# Altium schematic sheet 5V_switches.SchDoc: Data Logger - 5V Switches
size A4; DocumentNumber: DL-MB-5; SheetNumber: 5; SheetTotal: 11
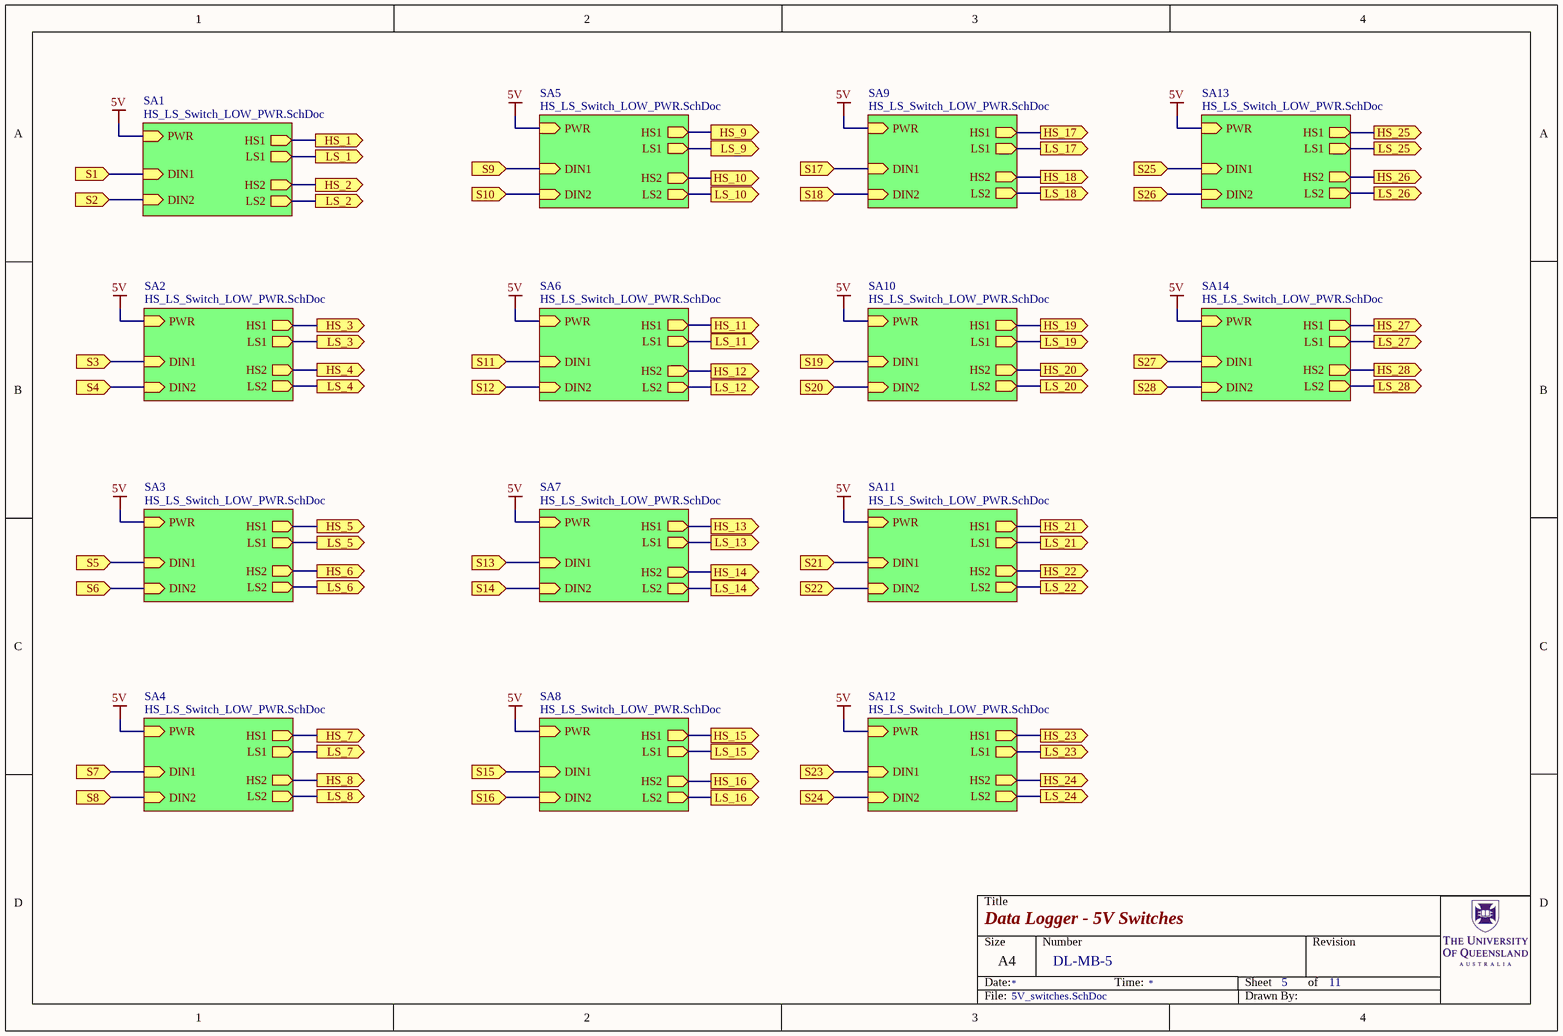
[diagram p0: 5V_switches.SchDoc]

## Sub-sheets
SA1 = HS_LS_Switch_LOW_PWR.SchDoc: DIN1 (in), DIN2 (in), HS1 (out), LS1 (out), HS2 (out), LS2 (out), PWR (in)
SA2 = HS_LS_Switch_LOW_PWR.SchDoc: DIN1 (in), DIN2 (in), HS1 (out), LS1 (out), HS2 (out), LS2 (out), PWR (in)
SA3 = HS_LS_Switch_LOW_PWR.SchDoc: DIN1 (in), DIN2 (in), HS1 (out), LS1 (out), HS2 (out), LS2 (out), PWR (in)
SA4 = HS_LS_Switch_LOW_PWR.SchDoc: DIN1 (in), DIN2 (in), HS1 (out), LS1 (out), HS2 (out), LS2 (out), PWR (in)
SA5 = HS_LS_Switch_LOW_PWR.SchDoc: DIN1 (in), DIN2 (in), HS1 (out), LS1 (out), HS2 (out), LS2 (out), PWR (in)
SA6 = HS_LS_Switch_LOW_PWR.SchDoc: DIN1 (in), DIN2 (in), HS1 (out), LS1 (out), HS2 (out), LS2 (out), PWR (in)
SA7 = HS_LS_Switch_LOW_PWR.SchDoc: DIN1 (in), DIN2 (in), HS1 (out), LS1 (out), HS2 (out), LS2 (out), PWR (in)
SA8 = HS_LS_Switch_LOW_PWR.SchDoc: DIN1 (in), DIN2 (in), HS1 (out), LS1 (out), HS2 (out), LS2 (out), PWR (in)
SA9 = HS_LS_Switch_LOW_PWR.SchDoc: DIN1 (in), DIN2 (in), HS1 (out), LS1 (out), HS2 (out), LS2 (out), PWR (in)
SA10 = HS_LS_Switch_LOW_PWR.SchDoc: DIN1 (in), DIN2 (in), HS1 (out), LS1 (out), HS2 (out), LS2 (out), PWR (in)
SA11 = HS_LS_Switch_LOW_PWR.SchDoc: DIN1 (in), DIN2 (in), HS1 (out), LS1 (out), HS2 (out), LS2 (out), PWR (in)
SA12 = HS_LS_Switch_LOW_PWR.SchDoc: DIN1 (in), DIN2 (in), HS1 (out), LS1 (out), HS2 (out), LS2 (out), PWR (in)
SA13 = HS_LS_Switch_LOW_PWR.SchDoc: DIN1 (in), DIN2 (in), HS1 (out), LS1 (out), HS2 (out), LS2 (out), PWR (in)
SA14 = HS_LS_Switch_LOW_PWR.SchDoc: DIN1 (in), DIN2 (in), HS1 (out), LS1 (out), HS2 (out), LS2 (out), PWR (in)

## Ports
HS_1 (out), HS_2 (out), HS_3 (out), HS_4 (out), HS_5 (out), HS_6 (out), HS_7 (out), HS_8 (out), HS_9 (out), HS_10 (out), HS_11 (out), HS_12 (out), HS_13 (out), HS_14 (out), HS_15 (out), HS_16 (out), HS_17 (out), HS_18 (out), HS_19 (out), HS_20 (out), HS_21 (out), HS_22 (out), HS_23 (out), HS_24 (out), HS_25 (out), HS_26 (out), HS_27 (out), HS_28 (out), LS_1 (out), LS_2 (out), LS_3 (out), LS_4 (out), LS_5 (out), LS_6 (out), LS_7 (out), LS_8 (out), LS_9 (out), LS_10 (out), LS_11 (out), LS_12 (out), LS_13 (out), LS_14 (out), LS_15 (out), LS_16 (out), LS_17 (out), LS_18 (out), LS_19 (out), LS_20 (out), LS_21 (out), LS_22 (out), LS_23 (out), LS_24 (out), LS_25 (out), LS_26 (out), LS_27 (out), LS_28 (out), S1 (in), S2 (in), S3 (in), S4 (in), S5 (in), S6 (in), S7 (in), S8 (in), S9 (in), S10 (in), S11 (in), S12 (in), S13 (in), S14 (in), S15 (in), S16 (in), S17 (in), S18 (in), S19 (in), S20 (in), S21 (in), S22 (in), S23 (in), S24 (in), S25 (in), S26 (in), S27 (in), S28 (in)

## Nets
5V: sheet SA1/PWR, sheet SA2/PWR, sheet SA3/PWR, sheet SA4/PWR, sheet SA5/PWR, sheet SA9/PWR, sheet SA10/PWR, sheet SA11/PWR, sheet SA12/PWR, sheet SA13/PWR, sheet SA14/PWR, sheet SA6/PWR, sheet SA7/PWR, sheet SA8/PWR
HS_1: port HS_1, sheet SA1/HS1
HS_2: port HS_2, sheet SA1/HS2
HS_3: port HS_3, sheet SA2/HS1
HS_4: port HS_4, sheet SA2/HS2
HS_5: port HS_5, sheet SA3/HS1
HS_6: port HS_6, sheet SA3/HS2
HS_7: port HS_7, sheet SA4/HS1
HS_8: port HS_8, sheet SA4/HS2
HS_9: port HS_9, sheet SA5/HS1
HS_10: port HS_10, sheet SA5/HS2
HS_11: port HS_11, sheet SA6/HS1
HS_12: port HS_12, sheet SA6/HS2
HS_13: port HS_13, sheet SA7/HS1
HS_14: port HS_14, sheet SA7/HS2
HS_15: port HS_15, sheet SA8/HS1
HS_16: port HS_16, sheet SA8/HS2
HS_17: port HS_17, sheet SA9/HS1
HS_18: port HS_18, sheet SA9/HS2
HS_19: port HS_19, sheet SA10/HS1
HS_20: port HS_20, sheet SA10/HS2
HS_21: port HS_21, sheet SA11/HS1
HS_22: port HS_22, sheet SA11/HS2
HS_23: port HS_23, sheet SA12/HS1
HS_24: port HS_24, sheet SA12/HS2
HS_25: port HS_25, sheet SA13/HS1
HS_26: port HS_26, sheet SA13/HS2
HS_27: port HS_27, sheet SA14/HS1
HS_28: port HS_28, sheet SA14/HS2
LS_1: port LS_1, sheet SA1/LS1
LS_2: port LS_2, sheet SA1/LS2
LS_3: port LS_3, sheet SA2/LS1
LS_4: port LS_4, sheet SA2/LS2
LS_5: port LS_5, sheet SA3/LS1
LS_6: port LS_6, sheet SA3/LS2
LS_7: port LS_7, sheet SA4/LS1
LS_8: port LS_8, sheet SA4/LS2
LS_9: port LS_9, sheet SA5/LS1
LS_10: port LS_10, sheet SA5/LS2
LS_11: port LS_11, sheet SA6/LS1
LS_12: port LS_12, sheet SA6/LS2
LS_13: port LS_13, sheet SA7/LS1
LS_14: port LS_14, sheet SA7/LS2
LS_15: port LS_15, sheet SA8/LS1
LS_16: port LS_16, sheet SA8/LS2
LS_17: port LS_17, sheet SA9/LS1
LS_18: port LS_18, sheet SA9/LS2
LS_19: port LS_19, sheet SA10/LS1
LS_20: port LS_20, sheet SA10/LS2
LS_21: port LS_21, sheet SA11/LS1
LS_22: port LS_22, sheet SA11/LS2
LS_23: port LS_23, sheet SA12/LS1
LS_24: port LS_24, sheet SA12/LS2
LS_25: port LS_25, sheet SA13/LS1
LS_26: port LS_26, sheet SA13/LS2
LS_27: port LS_27, sheet SA14/LS1
LS_28: port LS_28, sheet SA14/LS2
S1: port S1, sheet SA1/DIN1
S2: port S2, sheet SA1/DIN2
S3: port S3, sheet SA2/DIN1
S4: port S4, sheet SA2/DIN2
S5: port S5, sheet SA3/DIN1
S6: port S6, sheet SA3/DIN2
S7: port S7, sheet SA4/DIN1
S8: port S8, sheet SA4/DIN2
S9: port S9, sheet SA5/DIN1
S10: port S10, sheet SA5/DIN2
S11: port S11, sheet SA6/DIN1
S12: port S12, sheet SA6/DIN2
S13: port S13, sheet SA7/DIN1
S14: port S14, sheet SA7/DIN2
S15: port S15, sheet SA8/DIN1
S16: port S16, sheet SA8/DIN2
S17: port S17, sheet SA9/DIN1
S18: port S18, sheet SA9/DIN2
S19: port S19, sheet SA10/DIN1
S20: port S20, sheet SA10/DIN2
S21: port S21, sheet SA11/DIN1
S22: port S22, sheet SA11/DIN2
S23: port S23, sheet SA12/DIN1
S24: port S24, sheet SA12/DIN2
S25: port S25, sheet SA13/DIN1
S26: port S26, sheet SA13/DIN2
S27: port S27, sheet SA14/DIN1
S28: port S28, sheet SA14/DIN2

## Notes on the sheet
- Title
- Size
- Date:
- A4
- Number
- Time:
- Sheet
- of
- Revision
- File:
- Drawn By: